# Altium project Valdis.PrjPcb
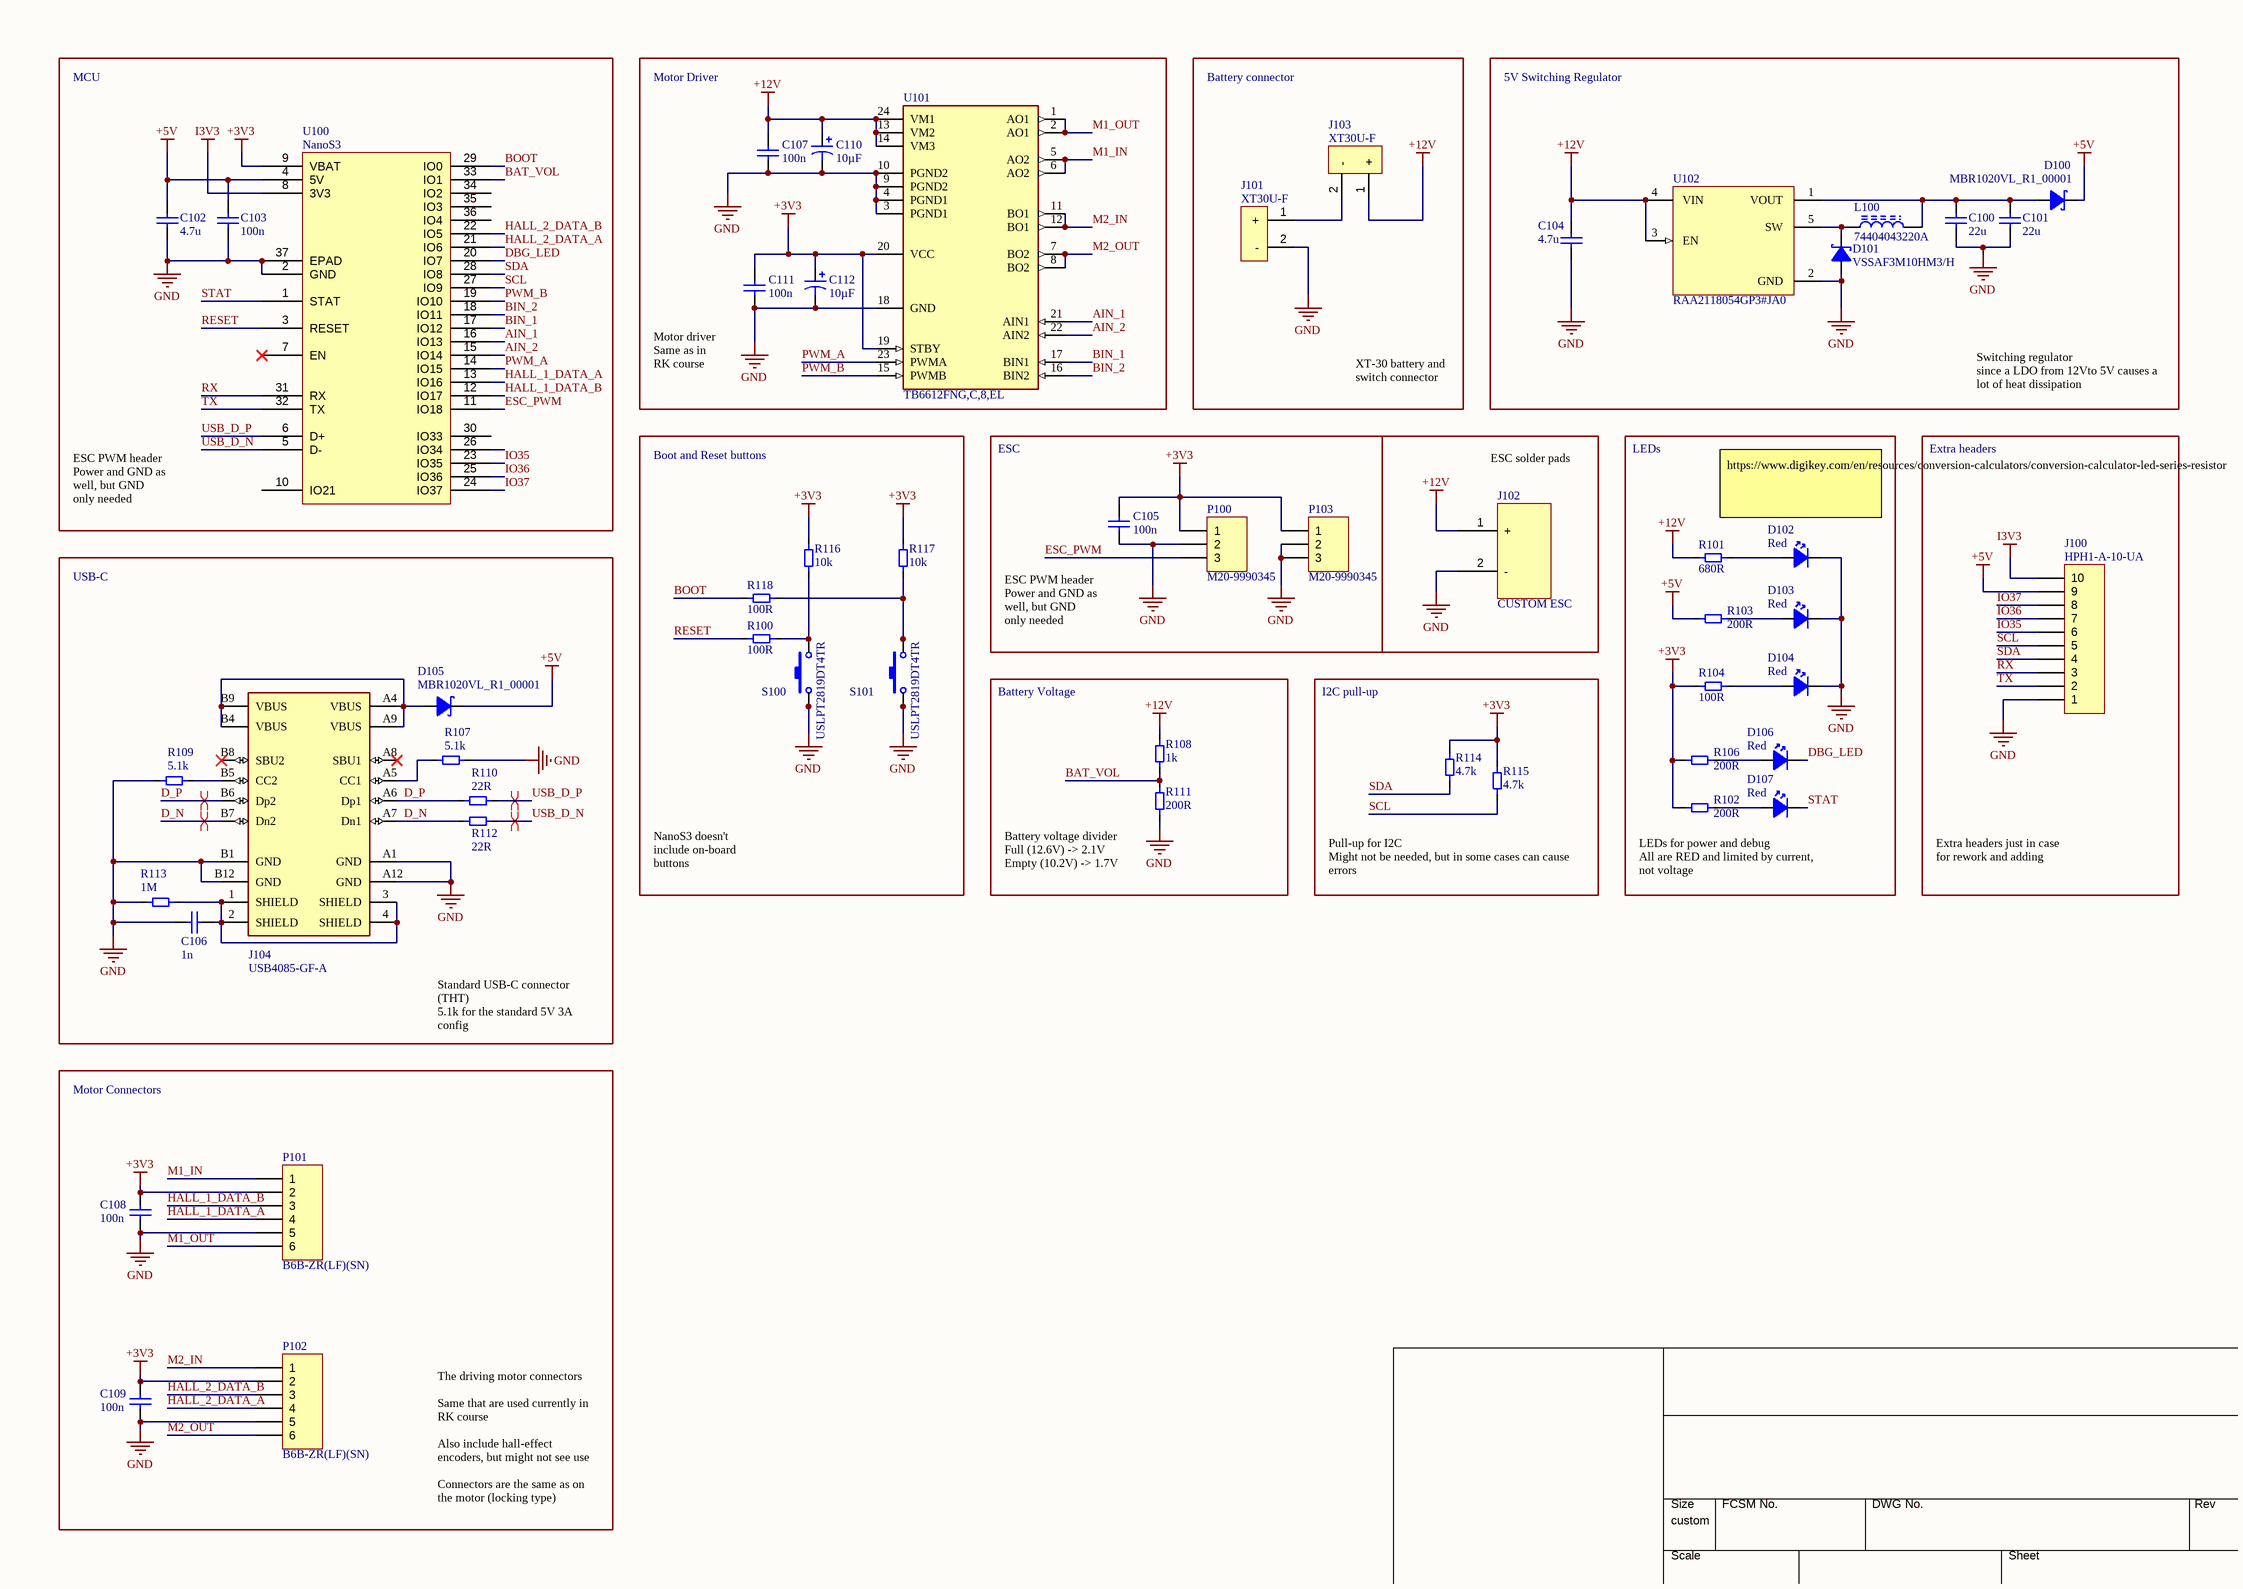
[diagram p0: Valdis.SchDoc]
GlobalRevisionEngineer: Robin Madar, Vadim Kokurin; GlobalRevisionDate: 2026-2-17; GlobalProjectTitle: Valdis; GlobalProjectRevision: v1; GlobalAddress2: Harju maakond; GlobalAddress: Tallinn
1 sheet, 54 parts. Net scope: global (net labels, ports and power ports of the same name join across sheets).
Board file: Valdis.PcbDoc

## Sheet Valdis.SchDoc
size 420 x 297 mm; SheetNumber: 1; SheetTotal: 1

### Parts
C100  22u  [MLCC_1206_M]
C101  22u  [MLCC_1206_M]
C102  4.7u  [MLCC_0805_M]
C103  100n  [MLCC_0603_M]
C104  4.7u  [MLCC_1206_M]
C105  100n  [MLCC_0603_M]
C106  1n  [MLCC_0603_M]
C107  100n  [MLCC_0603_M]
C108  100n  [MLCC_0603_M]
C109  100n  [MLCC_0603_M]
C110  value 10µF  [593D106X9025C2TE3-Footprint-1]  (hidden comment: T495B106K025ATE750)
C111  100n  [MLCC_0603_M]
C112  value 10µF  [593D106X9025C2TE3-Footprint-1]  (hidden comment: T495B106K025ATE750)
D100  MBR1020VL_R1_00001  [FP-MBR1020VL_R1_00001-MFG]
D101  VSSAF3M10HM3/H  [VSSAF3M10HM3_H-Footprint-1]
D102  Red  [0603 RED LED]
D103  Red  [0603 RED LED]
D104  Red  [0603 RED LED]
D105  MBR1020VL_R1_00001  [FP-MBR1020VL_R1_00001-MFG]
D106  Red  [0603 RED LED]
D107  Red  [0603 RED LED]
J100  HPH1-A-10-UA  [HPH1-A-10-UA]
J101  XT30U-F  [XT30U-F]
J102  CUSTOM ESC  [CUSTOM ESC-Footprint-1]
J103  XT30U-F  [XT30U-F]
J104  USB4085-GF-A  [FP-USB4085-GF-A-MFG]
L100  74404043220A  [WE-LQS_4025]
P100  M20-9990345  [3Pos Pin Header]
P101  B6B-ZR(LF)(SN)  [FP-B6B-ZR-SM4-TF_LF_SN-MFG]
P102  B6B-ZR(LF)(SN)  [FP-B6B-ZR-SM4-TF_LF_SN-MFG]
P103  M20-9990345  [3Pos Pin Header]
R100  100R  [Resistor_0603_M]
R101  680R  [Resistor_0603_M]
R102  200R  [Resistor_0603_M]
R103  200R  [Resistor_0603_M]
R104  100R  [Resistor_0603_M]
R106  200R  [Resistor_0603_M]
R107  5.1k  [Resistor_0603_M]
R108  1k  [Resistor_0603_M]
R109  5.1k  [Resistor_0603_M]
R110  22R  [Resistor_0603_M]
R111  200R  [Resistor_0603_M]
R112  22R  [Resistor_0603_M]
R113  1M  [Resistor_1206_M]
R114  4.7k  [Resistor_0603_M]
R115  4.7k  [Resistor_0603_M]
R116  10k  [Resistor_0603_M]
R117  10k  [Resistor_0603_M]
R118  100R  [Resistor_0603_M]
S100  USLPT2819DT4TR  [USLPT2819DT4TR-Footprint-1]
S101  USLPT2819DT4TR  [USLPT2819DT4TR-Footprint-1]
U100  NanoS3  [NanoS3]
U101  TB6612FNG,C,8,EL  [FP-SSOP24-P-300-0_65A-MFG]
U102  RAA2118054GP3#JA0  [P5_064B_MFG]

### Blocks framed on the sheet
MCU: C102 C103 U100
Motor Driver: C107 C110-C112 U101
Battery connector: J101 J103
5V Switching Regulator: C100 C101 C104 D100 D101 L100 U102
Boot and Reset buttons: R100 R116-R118 S100 S101
ESC: C105 P100 P103
LEDs: D102-D104 D106 D107 R101-R104 R106
Extra headers: J100
USB-C: C106 D105 J104 R107 R109 R110 R112 R113
Battery Voltage: R108 R111
I2C pull-up: R114 R115
Motor Connectors: C108 C109 P101 P102

### Nets
+3V3: C105.1 C108.2 C109.2 C111.1 C112.2 P100.1 P101.2 P102.2 P103.1 R102.1 R104.1 R106.1 R114.2 R115.2 R116.2 R117.2 U100.9(VBAT) U101.19(STBY) U101.20(VCC)
+5V: C102.2 C103.2 D100.1(C) D105.1(C) J100.9 R103.1 U100.4(5V)
+12V: C104.2 C107.1 C110.2 J102.1(+) J103.1(+) R101.2 R108.2 U101.13(VM2) U101.14(VM3) U101.24(VM1) U102.3(EN) U102.4(VIN)
GND: C100.1 C101.1 C102.1 C103.1 C104.1 C105.2 C106.2 C107.2 C108.1 C109.1 C110.1 C111.2 C112.1 D101.2(A) D102.1(C) D103.1(C) D104.1(C) J100.1 J101.2(-) J102.2(-) J104.A1(GND) J104.A12(GND) J104.B1(GND) J104.B12(GND) P100.2 P101.5 P102.5 P103.2 P103.3 R107.2 R109.1 R111.1 R113.2 S100.1 S100.2 S101.1 S101.2 U100.2(GND) U100.37(EPAD) U101.3(PGND1) U101.4(PGND1) U101.9(PGND2) U101.10(PGND2) U101.18(GND) U102.2(GND)
I3V3: J100.10 U100.8(3V3)
AIN_1: U100.16(IO13) U101.21(AIN1)
AIN_2: U100.15(IO14) U101.22(AIN2)
BAT_VOL: R108.1 R111.2 U100.33(IO1)
BIN_1: U100.17(IO12) U101.17(BIN1)
BIN_2: U100.18(IO11) U101.16(BIN2)
BOOT: R118.2 U100.29(IO0)
D_N: J104.A7(Dn1) J104.B7(Dn2) R112.1
D_P: J104.A6(Dp1) J104.B6(Dp2) R110.1
DBG_LED: D106.1(C) U100.20(IO7)
ESC_PWM: P100.3 U100.11(IO18)
HALL_1_DATA_A: P101.4 U100.13(IO16)
HALL_1_DATA_B: P101.3 U100.12(IO17)
HALL_2_DATA_A: P102.4 U100.21(IO6)
HALL_2_DATA_B: P102.3 U100.22(IO5)
IO35: J100.6 U100.23(IO35)
IO36: J100.7 U100.25(IO36)
IO37: J100.8 U100.24(IO37)
M1_IN: P101.1 U101.5(AO2) U101.6(AO2)
M1_OUT: P101.6 U101.1(AO1) U101.2(AO1)
M2_IN: P102.1 U101.11(BO1) U101.12(BO1)
M2_OUT: P102.6 U101.7(BO2) U101.8(BO2)
PWM_A: U100.14(IO15) U101.23(PWMA)
PWM_B: U100.19(IO10) U101.15(PWMB)
RESET: R100.2 U100.3(RESET)
RX: J100.3 U100.31(RX)
SCL: J100.5 R115.1 U100.27(IO9)
SDA: J100.4 R114.1 U100.28(IO8)
STAT: D107.1(C) U100.1(STAT)
TX: J100.2 U100.32(TX)
USB_D_N: R112.2 U100.5(D-)
USB_D_P: R110.2 U100.6(D+)
NetC100_2: C100.2 C101.2 D100.2(A) L100.2 U102.1(VOUT)
NetC106_1: C106.1 J104.1(SHIELD) J104.2(SHIELD) J104.3(SHIELD) J104.4(SHIELD) R113.1
NetD101_1: D101.1(C) L100.1 U102.5(SW)
NetD102_2: D102.2(A) R101.1
NetD103_2: D103.2(A) R103.2
NetD104_2: D104.2(A) R104.2
NetD105_2: D105.2(A) J104.A4(VBUS) J104.A9(VBUS) J104.B4(VBUS) J104.B9(VBUS)
NetD106_2: D106.2(A) R106.2
NetD107_2: D107.2(A) R102.2
NetJ101_1: J101.1(+) J103.2(-)
NetJ104_A5: J104.A5(CC1) R107.1
NetJ104_B5: J104.B5(CC2) R109.2
NetR100_1: R100.1 R116.1 S100.3 S100.4
NetR117_1: R117.1 R118.1 S101.3 S101.4

Not connected (* = marked no-connect by the designer): J104 A8(SBU1)* B8(SBU2)*; U100 7(EN)* 10(IO21) 26(IO34) 30(IO33) 34(IO2) 35(IO3) 36(IO4)

### Layout directives
differential pair: D_N, D_P, USB_D_N, USB_D_P

### Notes on the sheet
- (near C111) Motor driver
  Same as in RK course
- XT-30 battery and switch connector
- Switching regulator
  since a LDO from 12Vto 5V causes a lot of heat dissipation
- ESC PWM header
  Power and GND as well, but GND only needed
- (near J102) ESC solder pads
- https://www.digikey.com/en/resources/conversion-calculators/conversion-calculator-led-series-resistor
- (near C105) ESC PWM header
  Power and GND as well, but GND only needed
- NanoS3 doesn't include on-board buttons
- (near R111) Battery voltage divider
  Full (12.6V) -> 2.1V
  Empty (10.2V) -> 1.7V
- Pull-up for I2C
  Might not be needed, but in some cases can cause errors
- LEDs for power and debug
  All are RED and limited by current, not voltage
- Extra headers just in case
  for rework and adding
- Standard USB-C connector (THT)
  5.1k for the standard 5V 3A config
- The driving motor connectors
  Same that are used currently in RK course
  Also include hall-effect encoders, but might not see use
  Connectors are the same as on the motor (locking type)
- THIS DOCUMENT AND THE DATA DISCLOSED HEREIN OR
- HEREWITH IS THE PROPERTY OF ALTIUM LIMITED AND MAY
- DWG NO:
- REVISION
- REV:
- DESCRIPTION
- DATE
- APPROVED
- BE FREELY DISTRIBUTED IN WHOLE. NO RIGHTS ARE
- RESERVED OR EXPRESS OR IMPLIED WARANTEE GIVEN.
- ENG:
- APPROVALS
- PROJECT
- DSN:
- CHK:
- REFERENCE DOCUMENTS
- PROJECT REVISION:
- TITLE
- DOCUMENT REVISION:
- DESIGN ITEM:
- BOM:
- FAB DWG:
- PCB DWG:
- ASSY DWG:
- SCALE:
- A3
- SIZE
- CAGE CODE
- FILE NAME
- DWG NO.
- SHEET
- OF
- REV

### Library data of the parts
C100 C101 = CMP-001-1113-2: MLCC, 1206, 22u, 10%, 16V, X5R; Manufacturer: Any; Value: 22µF; Capacitor Type: Ceramic; Part number: MLCC, 1206, 22u, 10%, 16V, X5R; RoHS: Yes; Dielectric: X5R; Voltage: 16V; Tolerance: 10%; Mount: SMD; Case/Package: 1206
C102 = CMP-001-0828-2: MLCC, 0805, 4.7u, 10%, 50V, X5R; Manufacturer: Any; Capacitor Type: Ceramic; Value: 4,7µF; Mount: SMD; Case/Package: 0805; Dielectric: X5R; RoHS: Yes; Part number: MLCC, 0805, 4.7u, 10%, 50V, X5R; Voltage: 50V; Tolerance: 10%
C103 C108 C109 = CMP-001-0755-1: MLCC, 0603, 100n, 10%, 35V, X7R; Manufacturer: Any; Capacitor Type: Ceramic; Value: 100nF; Voltage: 35V; Case/Package: 0603; Part number: MLCC, 0603, 100n, 10%, 35V, X7R; RoHS: Yes; Tolerance: 10%; Dielectric: X7R; Mount: SMD
C104 = CMP-001-1124-2: MLCC, 1206, 4.7u, 10%, 35V, X5R; Manufacturer: Any; Capacitor Type: Ceramic; Value: 4,7µF; RoHS: Yes; Part number: MLCC, 1206, 4.7u, 10%, 35V, X5R; Voltage: 35V; Tolerance: 10%; Case/Package: 1206; Dielectric: X5R; Mount: SMD
C105 C107 C111 = CMP-001-0815-1: MLCC, 0603, 100n, 10%, 50V, X7R; Manufacturer: Any; Value: 100nF; Capacitor Type: Ceramic; Part number: MLCC, 0603, 100n, 10%, 50V, X7R; RoHS: Yes; Dielectric: X7R; Mount: SMD; Voltage: 50V; Tolerance: 10%; Case/Package: 0603
C106 = CMP-001-0786-1: MLCC, 0603, 1n, 10%, 50V, X7R; Manufacturer: Any; Value: 1nF; Capacitor Type: Ceramic; RoHS: Yes; Mount: SMD; Dielectric: X7R; Case/Package: 0603; Part number: MLCC, 0603, 1n, 10%, 50V, X7R; Voltage: 50V; Tolerance: 10%
C110 C112 = CMP-0001-00298-2: 10UF Solid MNO2 Tantalum Electrolytic Capacitor, 25 V DC +/-10%, T495 Series; Manufacturer: Any; Tolerance: 10%; Voltage: 25V; ESR (Equivalent Series Resistance): 750mΩ; Leakage Current: 2.5µA; Ripple Current: 54mA; Capacitor Type: Tantalum; Case/Package: B; Dielectric: Tantalum; Mount: SMD; Part number: T495B106K025ATE750; Pins: 2; RoHS: Compliant; Case Code (Imperial): 1411; Case Code (Metric): 3528; China RoHS: Compliant; Dielectric Material: Tantalum; Export Control Classification Number (ECCN) Code: EAR99; Harmonized Tariff Schedule (HTS) Code: 8532.21.00.50; Height: 1.9mm; Introduction Date: 2007-02-01; Length: 3.5mm; Lifecycle Status: Production; Max Operating Temperature: 125°C; Min Operating Temperature: -55°C; Mounting Technology: Surface Mount; Number of Terminals: 2; Packaging: Cut Tape; REACH SVHC: Yes; Termination: SMD/SMT; Voltage Rating: 25V; Voltage Rating (DC): 25V; Width: 2.8mm
D100 D105 = CMP-ROOT-01310-1: Rectifier Diode, Schottky, 1 Phase, 1 Element, 1A, 20V V(RRM), Silicon; Manufacturer: Panjit; Max Forward Surge Current (Ifsm): 45A; Max Junction Temperature (Tj): 125°C; Number of Elements: 1; Peak Reverse Current: 600µA; Case/Package: SOD-123FL; Mount: SMD; Part number: MBR1020VL_R1_00001; Pins: 2; RoHS: Compliant; Forward Current: 1A; Height: 1.1mm; Lifecycle Status: Production; Max Operating Temperature: 125°C; Max Output current: 1A; Max Repetitive Reverse Voltage (Vrrm): 20V; Min Operating Temperature: -55°C; Number of Terminals: 2; REACH SVHC: No; Reverse Standoff Voltage: 20V
D101 = CMP-ROOT-01308-1: Rectifier Diode, Schottky, 1 Phase, 1 Element, 2.3A, 100V V(RRM), Silicon, DO-221AC; Forward Voltage: 720mV; Max Forward Surge Current (Ifsm): 80A; Number of Elements: 1; Peak Reverse Current: 200µA; Case/Package: DO-221AC-2; Manufacturer: VSSAF3M10HM3/H; Mount: SMD; Part number: VSSAF3M10HM3/H; Pins: 2; RoHS: Compliant; Lifecycle Status: Production; Max Operating Temperature: 175°C; Max Output current: 2.3A; Min Operating Temperature: -40°C; Number of Terminals: 2; REACH SVHC: No; Reverse Standoff Voltage: 100V
D102-D104 D106 D107 = CMP-ROOT-00025-2: Generic red 0603 LED; Part number: Any Red 0603 LED; Manufacturer: Any; Color: Red; Case/Package: 0603; Mount: SMD; RoHS: Yes
J100 = CMP-001-1902-1: Conn Unshrouded Header HDR 10 POS 1.27mm Solder ST Top Entry Thru-Hole; Manufacturer: Adam Tech; Contact Resistance: 20mΩ; Current Rating: 1A; Dielectric Material: Polyethylene; Insulation Resistance: 5GΩ; Mount: TH; Part number: HPH1-A-10-UA; Pins: 10; RoHS: Compliant; Contact Gender: Male; Lifecycle Status: Production; Max Operating Temperature: 105°C; Min Operating Temperature: -40°C; Number of Rows: 1; REACH SVHC: Yes; Terminal Pitch: 1.27mm
J101 J103 = CMP-ROOT-01262-3: Power Connector; Manufacturer: AMASS; Case/Package: Non-standard; Mount: SMD; Part number: XT30U-F; Pins: 2; RoHS: Yes; Color: Yellow; Contact Material: Brass; Orientation: Straight
J102 = CMP-ROOT-01320-4: Custom ESC pinout; Manufacturer: None; Mount: SMD; Part number: None; Pins: 2; RoHS: Yes
J104 = CMP-001-1800-1: USB Connector, 16 Contact(s), Female, Right Angle, Solder Terminal, Locking, Receptacle; Manufacturer: GCT; Part number: USB4800-03-A; USB Standard: USB 2.0; Standoff Height: 3.5mm; USB PD: 3.2; Current Rating: 4.25A; Mating Cycles: 10000; Number of Contacts: 16; Number of Ports: 1; Shielding: Shielded; Voltage Rating: 20V; RoHS: Yes; Pins: 16; Mount: TH; Connector Type: USB; Contact Material: Copper Alloy; Contact Plating: Gold; Flammability Rating: UL94 V-0; Gender: Receptacle; Height: 3.66mm; Insulation Color: Black; Max Operating Temperature: 85°C; Min Operating Temperature: -40°C; Mounting Technology: Through Hole,Horizontal; Number of Positions: 16; Orientation: Right Angle; Packaging: Tape and Reel; Series: USB4085; Termination: Solder
L100 = CMP-ROOT-01309-1: General Purpose Inductor, 22uH, 20%, 1 Element, Nickel-zinc Ferrite-Core, SMD, 1616; Manufacturer: Wurth Elektronik; Value: 22µH; Current Rating: 1.11A; DC Resistance (DCR): 200mΩ; Case/Package: 4mm x 4mm; Mount: SMD; Part number: 74404043220A; Pins: 2; RoHS: Compliant; Ambient Temperature Range High: 85°C; Ambient Temperature Range Low: -40°C; Height: 2.5mm; Inductance Tolerance: 20%; Length: 4mm; Max Operating Temperature: 125°C; Min Operating Temperature: -40°C; Width: 4mm
P100 P103 = CMP-ROOT-00217-1: Connector Header Through Hole 3 position 0.100" (2.54mm); Manufacturer: Harwin Inc.; Insulation Resistance: 10GR; Number of Positions: 3; Voltage Rating (AC): 750V; Max Current Rating: 3A; Contact Resistance: 25mR; Connector Type: Male Pin; Min Operating Temperature: -40°C; Contact Material: Brass,Bronze; Package Quantity: 1000; Housing Material: Nylon; Contact Plating: Gold; Contact Mating Length: 0.24inch; Pitch: 2.54mm; Number of Rows: 1; REACH SVHC: No SVHC; Packaging: Bulk; Housing Color: Black; Width: 0.25inch; Number of Contacts: 3; Pins: 3; Mount: Through Hole; Radiation Hardening: No; RoHS: Yes; Weight: 0.006138oz; Depth: 2.54mm; Color: Black; Part number: M20-9990345; Case/Package: SIL; Termination: Solder; Max Operating Temperature: 105°C; Current Rating: 3A; Length: 7.62mm; Height: 0.125inch; Orientation: Straight
P101 P102 = CMP-ROOT-01270-3: Header for PCB; pitch 1.50mm; 6-contacts; THT; male; top entry; 50V/1A; Manufacturer: JST Sales America Inc.; Body Plating: Tin; Connector Type: Male Pin; Contact Resistance: 30mΩ; Current Rating: 1A; Insulation Resistance: 500MΩ; Max Voltage Rating (AC): 50V; Number of Contacts: 6; Panel Thickness: 3.5mm; Pitch: 1.5mm; Mount: TH; Part number: B6B-ZR; Pins: 6; RoHS: Compliant; China RoHS: Compliant; Color: Natural, White; Contact Gender: Male; Contact Material: Copper, Tin; Contact Mating Length: 2.3876mm; Contact Plating: Tin; Depth: 3.5mm; Fastening Type: Detent; Flammability Rating: UL94 V-0; Gender: Male; Height: 4.5mm; Housing Material: Polyamide; Lead Free: Lead Free; Lead Pitch: 1.5mm; Length: 3.048mm; Lifecycle Status: Production; Material: Nylon; Max Current Rating: 1A; Max Operating Temperature: 85°C; Min Operating Temperature: -25°C; Mounting Technology: Through Hole; Number of Positions: 6; Number of Rows: 1; Orientation: Straight; Packaging: Bulk; REACH SVHC: Yes; Terminal Pitch: 1.5mm; Termination: Solder; Voltage Rating: 50V; Voltage Rating (AC): 50V; Voltage Rating (DC): 50V; Weight: 28.349523g; Width: 5.08mm
R100 R118 = CMP-001-0054-5: Resistor, 0603, 100R, 1%, 1/10W; Manufacturer: Any; Value: 100; Power: 100mW; Case/Package: 0603; Mount: SMD; Part number: Resistor, 0603, 100R, 1%, 1/10W; Tolerance: 1%; RoHS: Yes
R101 = CMP-001-0074-3: Resistor, 0603, 680R, 1%, 1/10W; Manufacturer: Any; Power: 100mW; Value: 680; RoHS: Yes; Tolerance: 1%; Mount: SMD; Part number: Resistor, 0603, 680R, 1%, 1/10W; Case/Package: 0603
R102 R103 R106 = CMP-001-0060-2: Resistor, 0603, 200R, 1%, 1/10W; Manufacturer: Any; Value: 200; Power: 100mW; RoHS: Yes; Part number: Resistor, 0603, 200R, 1%, 1/10W; Mount: SMD; Tolerance: 1%; Case/Package: 0603
R104 = CMP-0001-00262-1: Resistor, 0603, 100R, ≤5%, ≥1/16W; Manufacturer: Any; Value: 100; Case/Package: 0603; Mount: SMD; Part number: Resistor, 0603, 100R, ≤5%, ≥1/16W; RoHS: Yes
R107 R109 = CMP-001-0094-2: Resistor, 0603, 5.1k, 1%, 1/10W; Manufacturer: Any; Power: 100mW; Value: 5,1k; Case/Package: 0603; Part number: Resistor, 0603, 5.1k, 1%, 1/10W; Mount: SMD; Tolerance: 1%; RoHS: Yes
R108 = CMP-0001-00237-1: Resistor, 0603, 1k, 0.1%, 1/16W; Manufacturer: Any; Mount: SMD; Part number: Any; RoHS: Yes; Case/Package: 0603; Value: 1k
R110 R112 = CMP-001-0038-3: Resistor, 0603, 22R, 1%, 1/10W; Manufacturer: Any; Value: 22; Power: 100mW; Part number: Resistor, 0603, 22R, 1%, 1/10W; Tolerance: 1%; Case/Package: 0603; Mount: SMD; RoHS: Yes
R111 = CMP-001-0061-2: Resistor, 0603, 220R, 1%, 1/10W; Manufacturer: Any; Power: 100mW; Value: 220; RoHS: Yes; Case/Package: 0603; Mount: SMD; Tolerance: 1%; Part number: Resistor, 0603, 220R, 1%, 1/10W
R113 = CMP-0001-00051-1: Resistor, 1206, 1M, 1%, 1/4W; Manufacturer: Any; Case/Package: 1206; RoHS: Yes; Value: 1M; Mount: SMD; Part number: Any
R114 R115 = CMP-001-0093-2: Resistor, 0603, 4.7k, 1%, 1/10W; Manufacturer: Any; Power: 100mW; Value: 4,7k; Part number: Resistor, 0603, 4.7k, 1%, 1/10W; Case/Package: 0603; RoHS: Yes; Tolerance: 1%; Mount: SMD
R116 R117 = CMP-001-0101-2: Resistor, 0603, 10k, 1%, 1/10W; Manufacturer: Any; Power: 100mW; Tolerance: 1%; Value: 10k; RoHS: Yes; Mount: SMD; Case/Package: 0603; Part number: Resistor, 0603, 10k, 1%, 1/10W
S100 S101 = CMP-ROOT-01290-3: Keypad Switch, SPST, 0.05A, 1.96N, Solder Terminal, Panel Mount; Manufacturer: TE Connectivity ALCOSWITCH Switches; Contact Current Rating: 50mA; Case/Package: Non-standard; Mount: SMD; Part number: USLPT2819DT4TR; RoHS: Compliant; China RoHS: Compliant; Color: Black; Contact Material: Stainless Steel; Contact Plating: Silver; Housing Material: Polyethylene; Lifecycle Status: Production; Max Current Rating: 50mA; Max Operating Temperature: 85°C; Min Operating Temperature: -40°C; Operating Force: 1.96N; Packaging: Tape & Reel; REACH SVHC: Yes; Throw Configuration: SPST
U100 = CMP-00023-1: Unexpected Maker's NanoS3 DevKit; Case/Package: DevKit; Manufacturer: Unexpected Maker; Mount: SMD; Part number: NanoS3; RoHS: Yes
U101 = CMP-00025-1: DC Motor Driver 2.7V to 5.5V 24-Pin SSOP Embossed T/R; Manufacturer Package Identifier: SSOP24-P-300-0.65A; Manufacturer: Toshiba; Interface: Parallel; Logic Function: AND; Max Output current: 1A; Max Power Dissipation: 1.36W; Max Supply Current: 2.2mA; Motor Type: Brushed; Number of Channels: 2; Operating Supply Voltage: 3V; Output Voltage: 15V; Switching Frequency: 100kHz; Case/Package: LSSOP; Export Control Classification Number (ECCN) Code: EAR99; Harmonized Tariff Schedule (HTS) Code: 8542.39.00.60; Height: 1.6mm; Height - Seated (Max): 1.6mm; Introduction Date: 2014-12-16; Length: 7.8mm; Lifecycle Status: Production; Max Operating Temperature: 85°C; Max Supply Voltage: 5.5V; Min Operating Temperature: -20°C; Min Supply Voltage: 2.7V; Mounting Technology: Surface Mount; Number of Circuits: 2; Number of Outputs: 2; Pins: 24; Number of Terminals: 24; Output Current: 1A; Packaging: Cut Tape (CT); REACH SVHC: Yes; RoHS: Compliant; Schedule B: 8542390000, 8542390000; Terminal Pitch: 650µm; Width: 5.6mm; Mount: SMD; Part number: TBG6612FNG
U102 = CMP-00019-3: Switching Regulator, Current-mode, 0.3A, 230kHz Switching Freq-Max, PDSO5; Manufacturer Lifecycle Status: ACTIVE; Manufacturer: Renesas / Intersil; Max Supply Voltage: 80V; Max Junction Temperature (Tj): 125°C; Max Output current: 300mA; Max Output Voltage: 5.15V; Min Input Voltage: 7V; Min Output Voltage: 3.18V; Nominal Supply Voltage: 18V; Nominal Output Voltage: 5V; Number of Circuits: 1; Pitch: 1mm; Topology: Buck; Case/Package: TSOT; Export Control Classification Number (ECCN) Code: EAR99; Harmonized Tariff Schedule (HTS) Code: 8540000000; Height: 850µm; Height - Seated (Max): 1.1mm; Length: 2.9mm; Lifecycle Status: Production; MSL: 3; Max Operating Temperature: 125°C; Max Switching Frequency: 230kHz; Min Operating Temperature: -40°C; Mounting Technology: Surface Mount; Pins: 5; Number of Terminals: 5; Package Quantity: 3000; Part Family: RAA211805; REACH SVHC: Yes; RoHS: Compliant; Terminal Pitch: 950µm; Width: 1.6mm; Mount: SMD; Part number: RAA2118054GP3#JA0